# Altium schematic sheet LNA.SchDoc: LNA+ATT
size A4; DocumentNumber: 16; Revision: 2.0; SheetNumber: 16; SheetTotal: 18
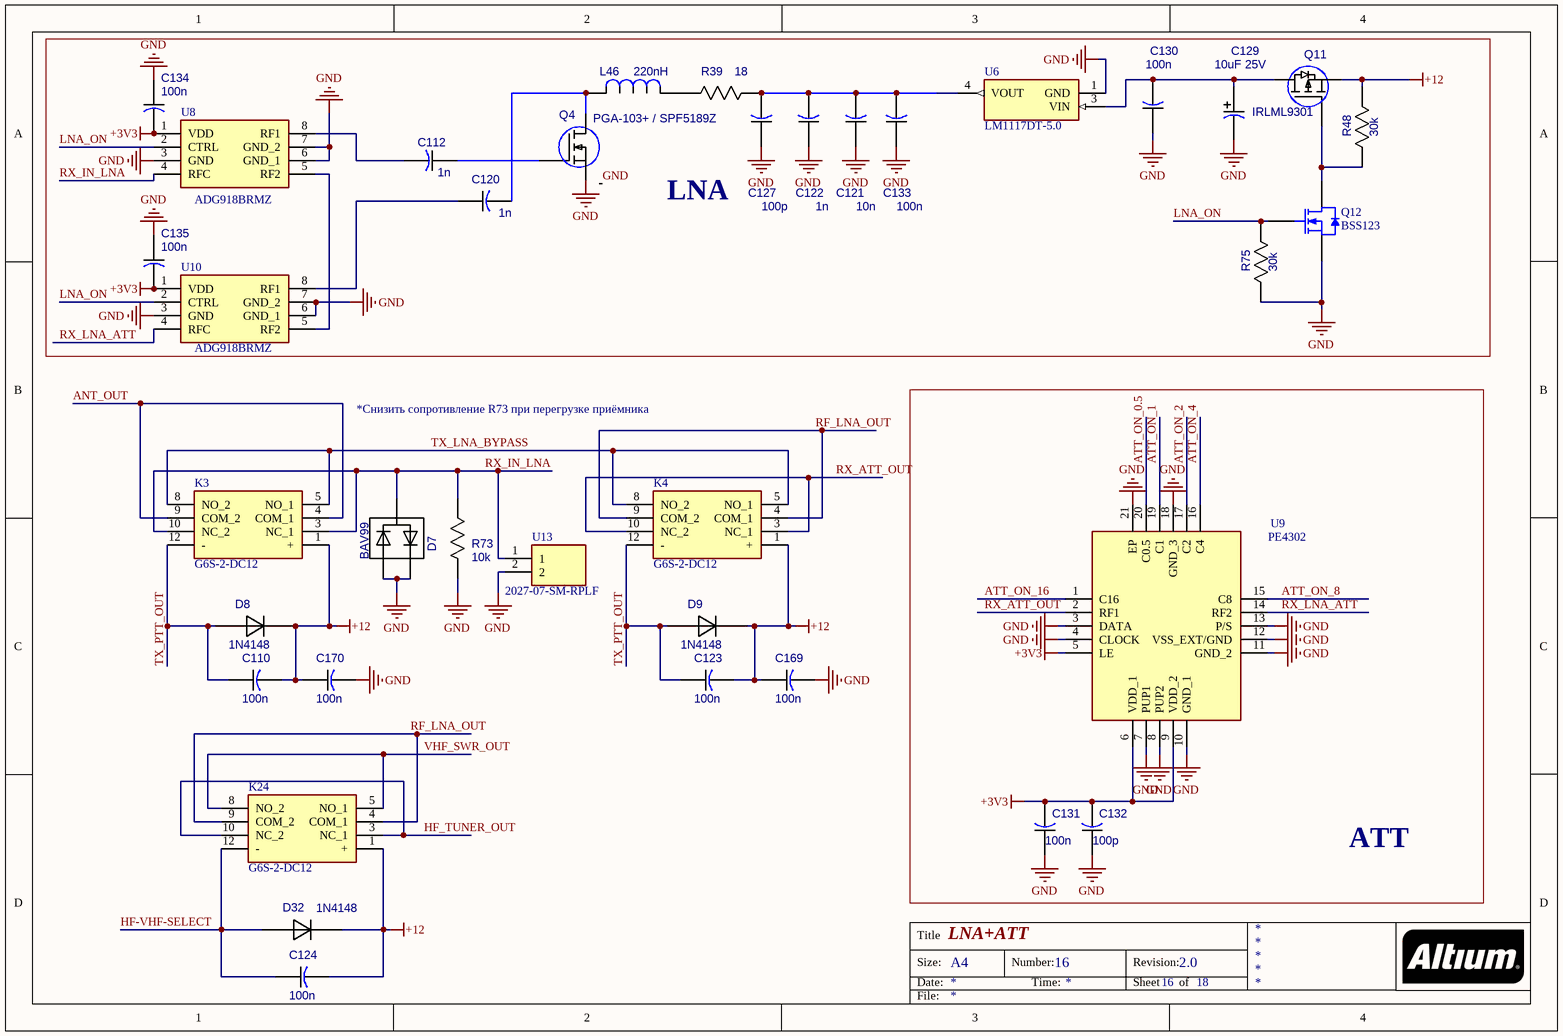
[diagram p0: LNA.SchDoc]

## Parts
C110  100n  [CAP_0805]
C112  1n  [CAP_0805]
C120  1n  [CAP_0805]
C121  10n  [6-0805_M]
C122  1n  [6-0805_M]
C123  100n  [CAP_0805]
C124  100n  [CAP_0805]
C127  100p  [6-0805_M]
C129  10uF 25V  [CAPAE_5.3x5.3h6.1]
C130  100n  [CAP_0805]
C131  100n  [6-0805_M]
C132  100p  [6-0805_M]
C133  100n  [CAP_0805]
C134  100n  [CAP_0805]
C135  100n  [CAP_0805]
C169  100n  [CAP_0805]
C170  100n  [CAP_0805]
D7  BAV99  [SOT23]
D8  1N4148  [SS14]
D9  1N4148  [SS14]
D32  1N4148  [SS14]
K3  G6S-2-DC12  [G6S2DC12]
K4  G6S-2-DC12  [G6S2DC12]
K24  G6S-2-DC12  [G6S2DC12]
L46  220nH  [IND_1206]
Q4  PGA-103+ / SPF5189Z  [SOT89]
Q11  IRLML9301  [SOT23]
Q12  BSS123  [FAIR-SOT23-3_V]
R39  18  [RES_1206]
R48  30k  [RES_0805]
R73  10k  [RES_1206]
R75  30k  [RES_0805]
U6  LM1117DT-5.0  [TO228P991X238-3N]
U8  ADG918BRMZ  [SOP65P490X110-8N]
U9  PE4302  [QFN50P400X400X90-21N]
U10  ADG918BRMZ  [SOP65P490X110-8N]
U13  2027-07-SM-RPLF  [200307SMRPLF]

## Blocks framed on the sheet
LNA: C112 C120-C122 C127 C129 C130 C133-C135 L46 Q4 Q11 Q12 R39 R48 R75 U6 U8 U10
ATT: C131 C132 U9

## Nets
+3V3: C131.2 C132.2 C134.2 C135.2 U8.1(VDD) U9.5(LE) U9.6(VDD_1) U9.9(VDD_2) U10.1(VDD)
+12: C110.2 C123.2 C124.2 C169.1 C170.1 D8.1(K) D9.1(K) D32.1(K) K3.1(+) K4.1(+) K24.1(+) Q11.2(S) R48.2
GND: C121.1 C122.1 C127.1 C129.2(MINUS) C130.1 C131.1 C132.1 C133.1 C134.1 C135.1 C169.2 C170.2 D7.1(A(D1)) D7.2(C(D2)) Q4.0 Q4.2(S) Q12.2(S) R73.1 R75.1 U6.1(GND) U8.3(GND) U8.6(GND_1) U8.7(GND_2) U9.3(DATA) U9.4(CLOCK) U9.7(PUP1) U9.8(PUP2) U9.10(GND_1) U9.11(GND_2) U9.12(VSS_EXT/GND) U9.13(P/S) U9.18(GND_3) U9.21(EP) U10.3(GND) U10.6(GND_1) U10.7(GND_2) U13.2
ANT_OUT: K3.4(COM_1) K3.9(COM_2)
ATT_ON_0.5: U9.20(C0.5)
ATT_ON_1: U9.19(C1)
ATT_ON_2: U9.17(C2)
ATT_ON_4: U9.16(C4)
ATT_ON_8: U9.15(C8)
ATT_ON_16: U9.1(C16)
HF-VHF-SELECT: C124.1 D32.2(A) K24.12(-)
HF_TUNER_OUT: K24.3(NC_1) K24.10(NC_2)
LNA_ON: Q12.1(G) R75.2 U8.2(CTRL) U10.2(CTRL)
RF_LNA_OUT: K4.4(COM_1) K4.9(COM_2) K24.4(COM_1) K24.9(COM_2)
RX_ATT_OUT: K4.3(NC_1) K4.10(NC_2) U9.2(RF1)
RX_IN_LNA: D7.3(C(D1),A(D2)) K3.3(NC_1) K3.10(NC_2) R73.2 U8.4(RFC) U13.1
RX_LNA_ATT: U9.14(RF2) U10.4(RFC)
TX_LNA_BYPASS: K3.5(NO_1) K3.8(NO_2) K4.5(NO_1) K4.8(NO_2)
TX_PTT_OUT: C110.1 C123.1 D8.2(A) D9.2(A) K3.12(-) K4.12(-)
VHF_SWR_OUT: K24.5(NO_1) K24.8(NO_2)
NetC112_1: C112.1 Q4.1(G)
NetC112_2: C112.2 U8.8(RF1)
NetC120_1: C120.1 U10.8(RF1)
NetC120_2: C120.2 L46.2 Q4.3(D)
NetC121_2: C121.2 C122.2 C127.2 C133.2 R39.1 U6.4(VOUT)
NetC129_1: C129.1(PLUS) C130.2 Q11.3(D) U6.3(VIN)
NetL46_1: L46.1 R39.2
NetQ11_1: Q11.1(G) Q12.3(D) R48.1
NetU8_5: U8.5(RF2) U10.5(RF2)

## Notes on the sheet
- *Снизить сопротивление R73 при перегрузке приёмника
- Title
- Size:
- Date:
- A4
- Number:
- Time:
- Revision:
- Sheet
- of
- File:

## Library data of the parts
C110 C112 C120-C124 C127 C130-C135 C169 C170 = CAP_0805
  C121: Value: 10n
  C122: Value: 1n
  C127 C132: Value: 100p
  C130 C131 C133-C135: Value: 100n
C129 = CAPAE_5.3x5.3h6.1: Value: 10uF 25V
K3 K4 K24 = G6S-2-DC12: Relay or Contactor; Manufacturer_Name: Omron Electronics; Datasheet Link: https://componentsearchengine.com/Datasheets/1/G6S-2-DC12.pdf; Height: 9.4mm; Manufacturer_Part_Number: G6S-2-DC12; Mouser Part Number: 653-G6S-2-DC12A; Mouser Price/Stock: https://www.mouser.co.uk/ProductDetail/Omron-Electronics/G6S-2-DC12/?qs=QGk6feVlqMLN9Ouv0QsFzA%3D%3D
L46 = IND_1206: Value: 220nH
Q4 = PGA-103+
Q11 = MOSFET_ENH_PD: MOSFET; Value: IRLML9301
Q12 = CMP-2000-04934-1: N-Channel Logic Level Enhancement Mode Field Effect Transistor, 1.7 V, -55 to 150 degC, 3-Pin SOT-23, RoHS, Tape and Reel; Manufacturer: Fairchild; Channel Type: N; Typical Turn-Off Delay Time: 17ns; Maximum Continuous Drain Current: 0.17A; Rad Hard: No; Typical Rise Time: 9ns; Typical Fall Time: 2.4ns; Maximum Gate Source Voltage: ±20V; Maximum Drain Source Voltage: 100V; Typical Turn-On Delay Time: 1.7ns; RDS-on: 6000@10VmOhm; Package Version: Rev. 12, 03/2016; Packaging: Tape&Reel; Package Reference: SOT23-3; Channel Mode: Enhancement; Operating Temperature: -55to150degC; Package Description: 3-Pin Small Outline Transistor, Body 2.92 x 1.325 mm, Pitch 0.95 mm; Category: MOSFET; Datasheet Version: Jun-03; Datasheet URL: https://www.fairchildsemi.com/datasheets/BS/BSS123.pdf; Manufacturer URL: https://www.fairchildsemi.com/; Mounting: SurfaceMount; Package: 3SOT-23; Package URL: http://www.fairchildsemi.com/dwg/MA/MA03D.pdf
R39 R73 = RES_1206
  R39: Value: 18
R48 R75 = RES_0805: Value: 30k
U6 = LM1117DT-ADJ: Integrated Circuit; Manufacturer_Name: Texas Instruments; Datasheet Link: http://www.ti.com/lit/ds/symlink/lm1117-n.pdf; Height: 2.38mm; Manufacturer_Part_Number: LM1117DT-ADJ; Mouser Part Number: 926-LM1117DT-ADJ; Mouser Price/Stock: https://www.mouser.com/Search/Refine.aspx?Keyword=926-LM1117DT-ADJ
U8 U10 = ADG918BRMZ: Integrated Circuit; Manufacturer_Name: Analog Devices; Datasheet Link: http://www.analog.com/static/imported-files/data_sheets/ADG918_919.pdf; Height: 1.1mm; Manufacturer_Part_Number: ADG918BRMZ; Mouser Part Number: 584-ADG918BRMZ; Mouser Price/Stock: https://www.mouser.co.uk/ProductDetail/Analog-Devices/ADG918BRMZ?qs=BpaRKvA4VqHrp1TCwMhfnw%3D%3D; RS Part Number: 4969212P; RS Price/Stock: http://uk.rs-online.com/web/p/products/4969212P
U9 = PE4312C-Z: Integrated Circuit; Manufacturer_Name: pSemi; Datasheet Link: https://www.psemi.com/pdf/datasheets/pe4312ds.pdf; Height: 0.9mm; Manufacturer_Part_Number: PE4312C-Z; Mouser Part Number: N/A; Mouser Price/Stock: https://www.mouser.com/Search/Refine.aspx?Keyword=N%2FA
U13 = 2003-07-SM-RPLF: Undefined or Miscellaneous; Manufacturer_Name: Bourns; Datasheet Link: https://www.arrow.com/en/products/2003-07-sm-rplf/bourns; Height: 3.7mm; Manufacturer_Part_Number: 2003-07-SM-RPLF; Mouser Part Number: 652-2003-07-SM-RPLF; Mouser Price/Stock: https://www.mouser.co.uk/ProductDetail/Bourns/2003-07-SM-RPLF?qs=j%252B1pi9TdxUaYVLyv%2F6mAaA%3D%3D; Arrow Part Number: 2003-07-SM-RPLF; Arrow Price/Stock: https://www.arrow.com/en/products/2003-07-sm-rplf/bourns
D7 = BAV99: Value: BAV99
D8 D9 D32 = 1N4148: Value: *